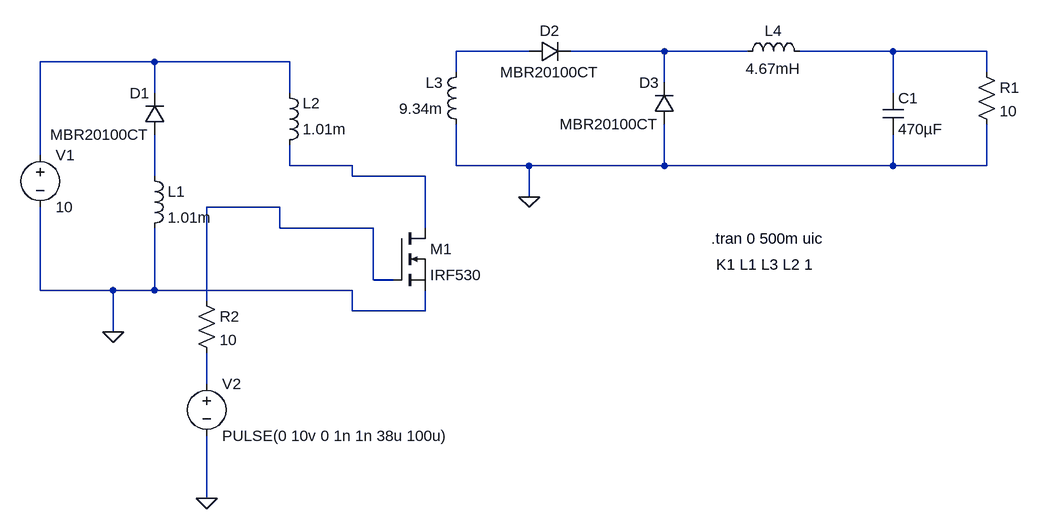
[diagram p0: schematic Ltspice_forward_converter_schematic.asc]
Ltspice_forward_converter_schematic.asc, the LTspice schematic file:
Version 4.1
SHEET 1 1528 708
WIRE 768 0 656 0
WIRE 976 0 832 0
WIRE 1104 0 976 0
WIRE 1328 0 1184 0
WIRE 1472 0 1328 0
WIRE 192 16 16 16
WIRE 400 16 192 16
WIRE 656 32 656 0
WIRE 1472 32 1472 0
WIRE 976 48 976 0
WIRE 192 64 192 16
WIRE 400 64 400 16
WIRE 1328 64 1328 0
WIRE 16 160 16 16
WIRE 400 176 400 144
WIRE 496 176 400 176
WIRE 656 176 656 112
WIRE 768 176 656 176
WIRE 976 176 976 112
WIRE 976 176 768 176
WIRE 1328 176 1328 128
WIRE 1328 176 976 176
WIRE 1472 176 1472 112
WIRE 1472 176 1328 176
WIRE 192 192 192 128
WIRE 496 192 496 176
WIRE 608 192 496 192
WIRE 768 224 768 176
WIRE 384 240 272 240
WIRE 384 272 384 240
WIRE 528 272 384 272
WIRE 608 272 608 192
WIRE 528 352 528 272
WIRE 560 352 528 352
WIRE 16 368 16 240
WIRE 128 368 16 368
WIRE 192 368 192 272
WIRE 192 368 128 368
WIRE 496 368 192 368
WIRE 272 384 272 240
WIRE 496 400 496 368
WIRE 608 400 608 368
WIRE 608 400 496 400
WIRE 128 432 128 368
WIRE 272 512 272 464
WIRE 272 688 272 592
FLAG 128 432 0
FLAG 768 224 0
FLAG 272 688 0
SYMBOL voltage 16 144 R0
WINDOW 123 0 0 Left 0
WINDOW 39 0 0 Left 0
SYMATTR InstName V1
SYMATTR Value 10
SYMBOL diode 208 128 R180
WINDOW 0 24 64 Left 2
WINDOW 3 24 0 Left 2
SYMATTR InstName D1
SYMATTR Value MBR20100CT
SYMBOL ind 176 176 R0
SYMATTR InstName L1
SYMATTR Value 1.01m
SYMATTR Type ind
SYMBOL ind 384 160 M180
WINDOW 0 36 80 Left 2
WINDOW 3 36 40 Left 2
SYMATTR InstName L2
SYMATTR Value 1.01m
SYMATTR Type ind
SYMBOL ind 672 128 R180
WINDOW 0 36 80 Left 2
WINDOW 3 36 40 Left 2
SYMATTR InstName L3
SYMATTR Value 9.34m
SYMATTR Type ind
SYMBOL diode 768 16 R270
WINDOW 0 32 32 VTop 2
WINDOW 3 0 32 VBottom 2
SYMATTR InstName D2
SYMATTR Value MBR20100CT
SYMBOL diode 992 112 R180
WINDOW 0 24 64 Left 2
WINDOW 3 24 0 Left 2
SYMATTR InstName D3
SYMATTR Value MBR20100CT
SYMBOL ind 1088 16 R270
WINDOW 0 32 56 VTop 2
WINDOW 3 5 56 VBottom 2
SYMATTR InstName L4
SYMATTR Value 4.67mH
SYMATTR SpiceLine Rser=0.56
SYMBOL res 1456 16 R0
SYMATTR InstName R1
SYMATTR Value 10
SYMBOL cap 1312 64 R0
SYMATTR InstName C1
SYMATTR Value 470µF
SYMBOL voltage 272 496 R0
WINDOW 123 0 0 Left 0
WINDOW 39 0 0 Left 0
SYMATTR InstName V2
SYMATTR Value PULSE(0 10v 0 1n 1n 38u 100u)
SYMBOL res 256 368 R0
SYMATTR InstName R2
SYMATTR Value 10
SYMBOL nmos 560 272 R0
SYMATTR InstName M1
SYMATTR Value IRF530
TEXT 1056 328 Left 2 !K1 L1 L3 L2 1
TEXT 1048 288 Left 2 !.tran 0 500m uic

The netlist it stands for:
* Ltspice_forward_converter_schematic.asc
V1 N004 0 10
D1 N006 N004 MBR20100CT
L1 N006 0 1.01m
L2 N005 N004 1.01m
L3 0 N001 9.34m
D2 N001 N002 MBR20100CT
D3 0 N002 MBR20100CT
L4 N002 N003 4.67mH Rser=0.56
R1 N003 0 10
C1 N003 0 470µF
V2 N008 0 PULSE(0 10v 0 1n 1n 38u 100u)
R2 N007 N008 10
M1 N005 N007 0 0 IRF530
.model D D
.lib standard.dio
.model NMOS NMOS
.model PMOS PMOS
.lib standard.mos
K1 L1 L3 L2 1
.tran 0 500m uic
.backanno
.end